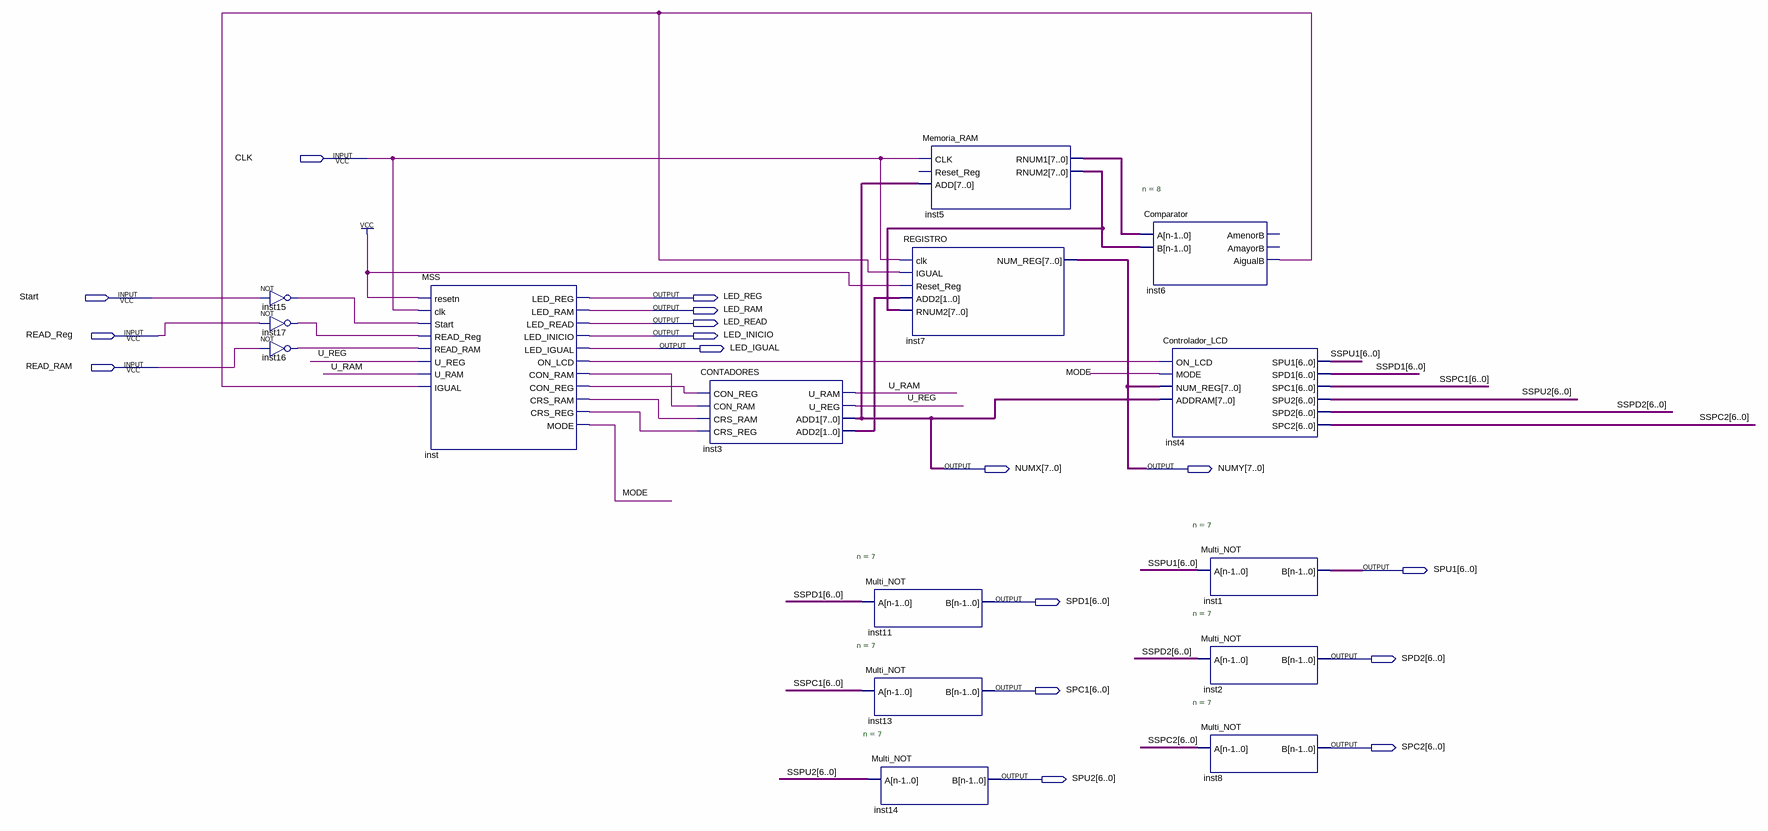
[diagram p0: schematic sheet]
// Quartus schematic Proyecto.bdf as structural Verilog: 15 symbols, 17 pins
module Proyecto (
  input  CLK,
  input  Start,
  input  READ_Reg,
  input  READ_RAM,
  output LED_REG,
  output LED_RAM,
  output LED_READ,
  output LED_INICIO,
  output LED_IGUAL,
  output [7:0] NUMX,
  output [7:0] NUMY,
  output [6:0] SPU1,
  output [6:0] SPD1,
  output [6:0] SPD2,
  output [6:0] SPC1,
  output [6:0] SPC2,
  output [6:0] SPU2
);

  wire inst6_aigualb, inst15_out, inst16_out, inst17_out, inst_con_ram, inst_con_reg, inst_crs_ram,
       inst_crs_reg, inst_on_lcd, MODE, U_RAM, U_REG;
  wire [1:0] inst3_add2;
  wire [6:0] SSPC1, SSPC2, SSPD1, SSPD2, SSPU1, SSPU2;
  wire [7:0] inst5_rnum1, inst5_rnum2;

  not inst15 (inst15_out, Start);
  not inst17 (inst17_out, READ_Reg);
  not inst16 (inst16_out, READ_RAM);
  MSS inst (
    .resetn(1'b1), .clk(CLK), .Start(inst15_out), .READ_Reg(inst17_out), .READ_RAM(inst16_out),
    .U_REG(U_REG), .U_RAM(U_RAM), .IGUAL(inst6_aigualb), .LED_REG(LED_REG), .LED_RAM(LED_RAM),
    .LED_READ(LED_READ), .LED_INICIO(LED_INICIO), .LED_IGUAL(LED_IGUAL), .ON_LCD(inst_on_lcd),
    .CON_RAM(inst_con_ram), .CON_REG(inst_con_reg), .CRS_RAM(inst_crs_ram), .CRS_REG(inst_crs_reg),
    .MODE(MODE));
  CONTADORES inst3 (
    .CON_REG(inst_con_reg), .CON_RAM(inst_con_ram), .CRS_RAM(inst_crs_ram), .CRS_REG(inst_crs_reg),
    .U_RAM(U_RAM), .U_REG(U_REG), .ADD1(NUMX), .ADD2(inst3_add2));
  REGISTRO inst7 (
    .clk(CLK), .IGUAL(inst6_aigualb), .Reset_Reg(1'b1), .ADD2(inst3_add2), .RNUM2(inst5_rnum2), .NUM_REG(NUMY));
  Multi_NOT #(.n(7)) inst11 (.A(SSPD1), .B(SPD1));
  Multi_NOT #(.n(7)) inst13 (.A(SSPC1), .B(SPC1));
  Multi_NOT #(.n(7)) inst14 (.A(SSPU2), .B(SPU2));
  Memoria_RAM inst5 (.CLK(CLK), .ADD(NUMX), .RNUM1(inst5_rnum1), .RNUM2(inst5_rnum2));  // open: Reset_Reg
  Comparator #(.n(8)) inst6 (.A(inst5_rnum1), .B(inst5_rnum2), .AigualB(inst6_aigualb));  // open: AmenorB, AmayorB
  Controlador_LCD inst4 (
    .ON_LCD(inst_on_lcd), .MODE(MODE), .NUM_REG(NUMY), .ADDRAM(NUMX), .SPU1(SSPU1), .SPD1(SSPD1),
    .SPC1(SSPC1), .SPU2(SSPU2), .SPD2(SSPD2), .SPC2(SSPC2));
  Multi_NOT #(.n(7)) inst1 (.A(SSPU1), .B(SPU1));
  Multi_NOT #(.n(7)) inst2 (.A(SSPD2), .B(SPD2));
  Multi_NOT #(.n(7)) inst8 (.A(SSPC2), .B(SPC2));
endmodule
